# EAGLE design main_board (EAGLE 9.6.2)
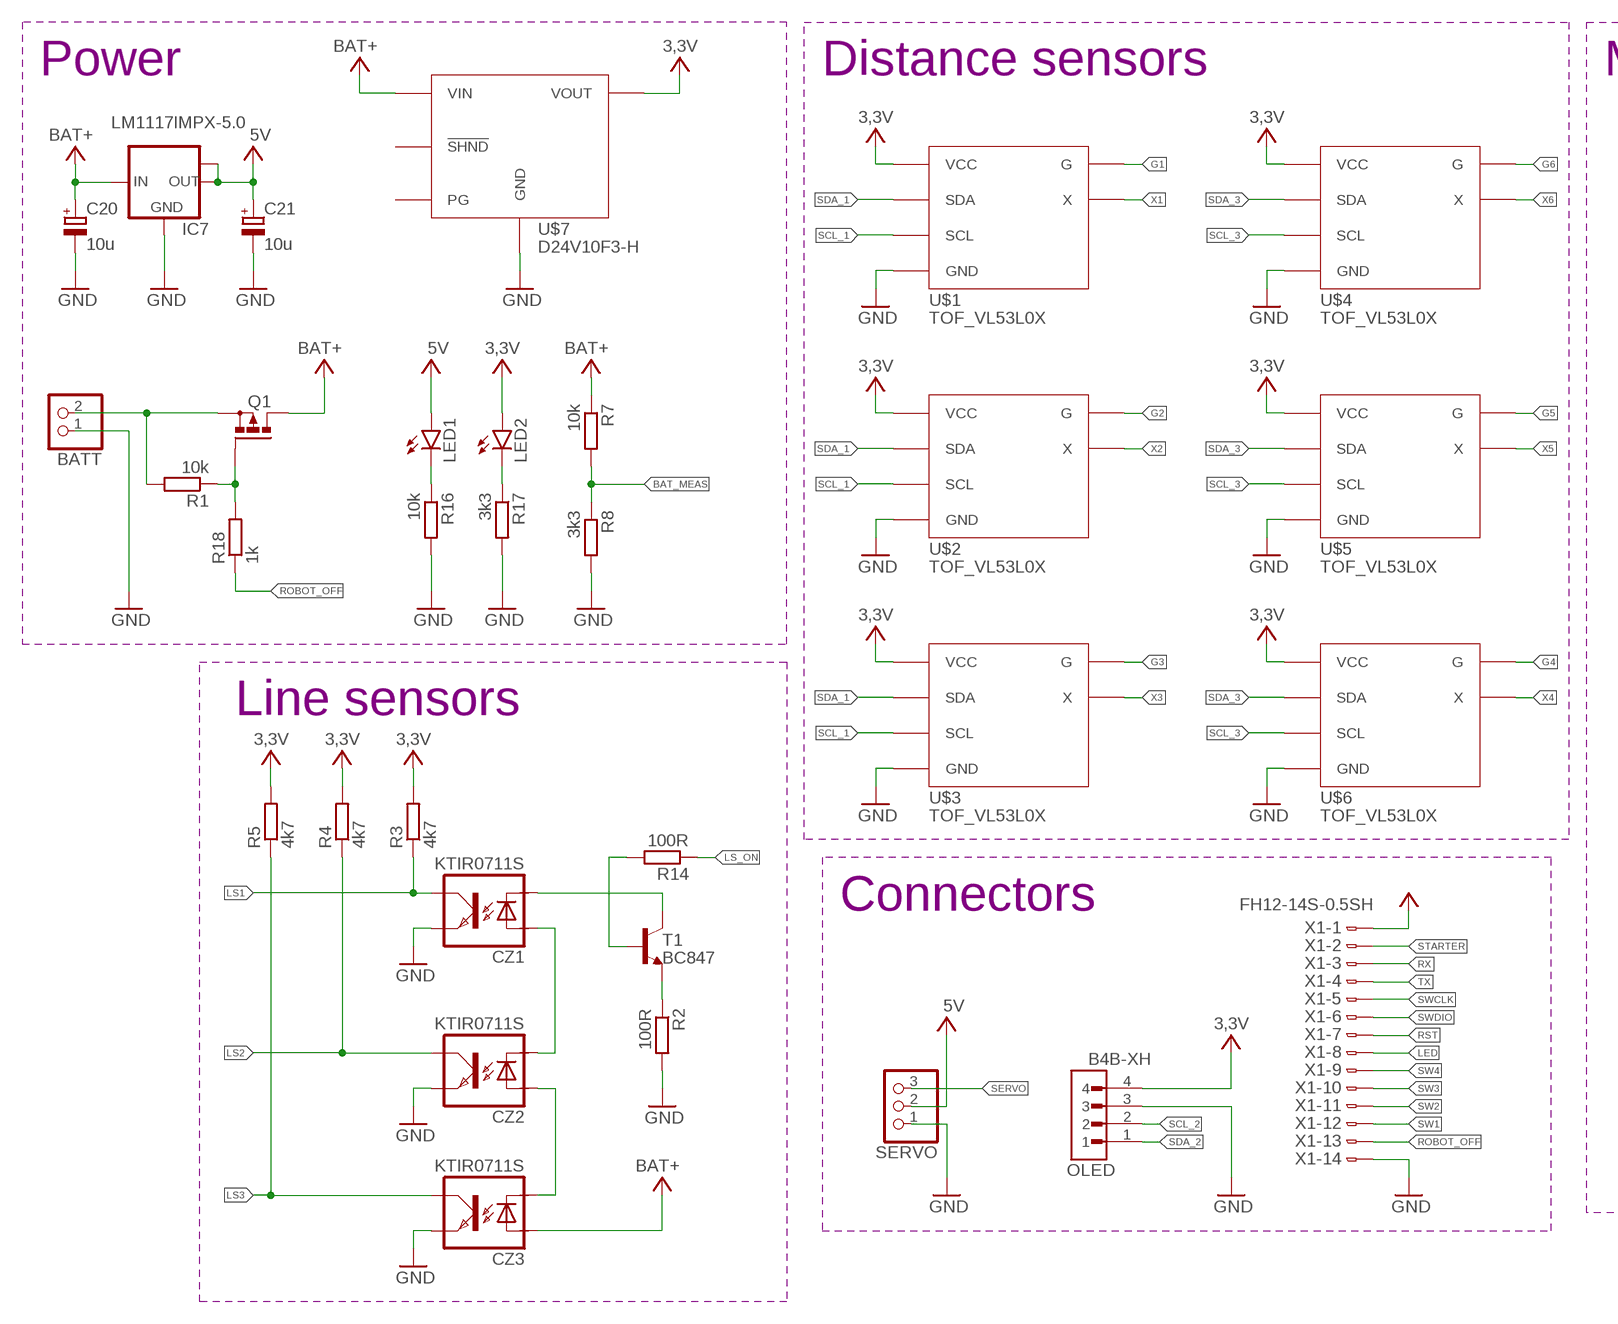
[diagram p0: schematic, sheet 1, part 1 of 2]
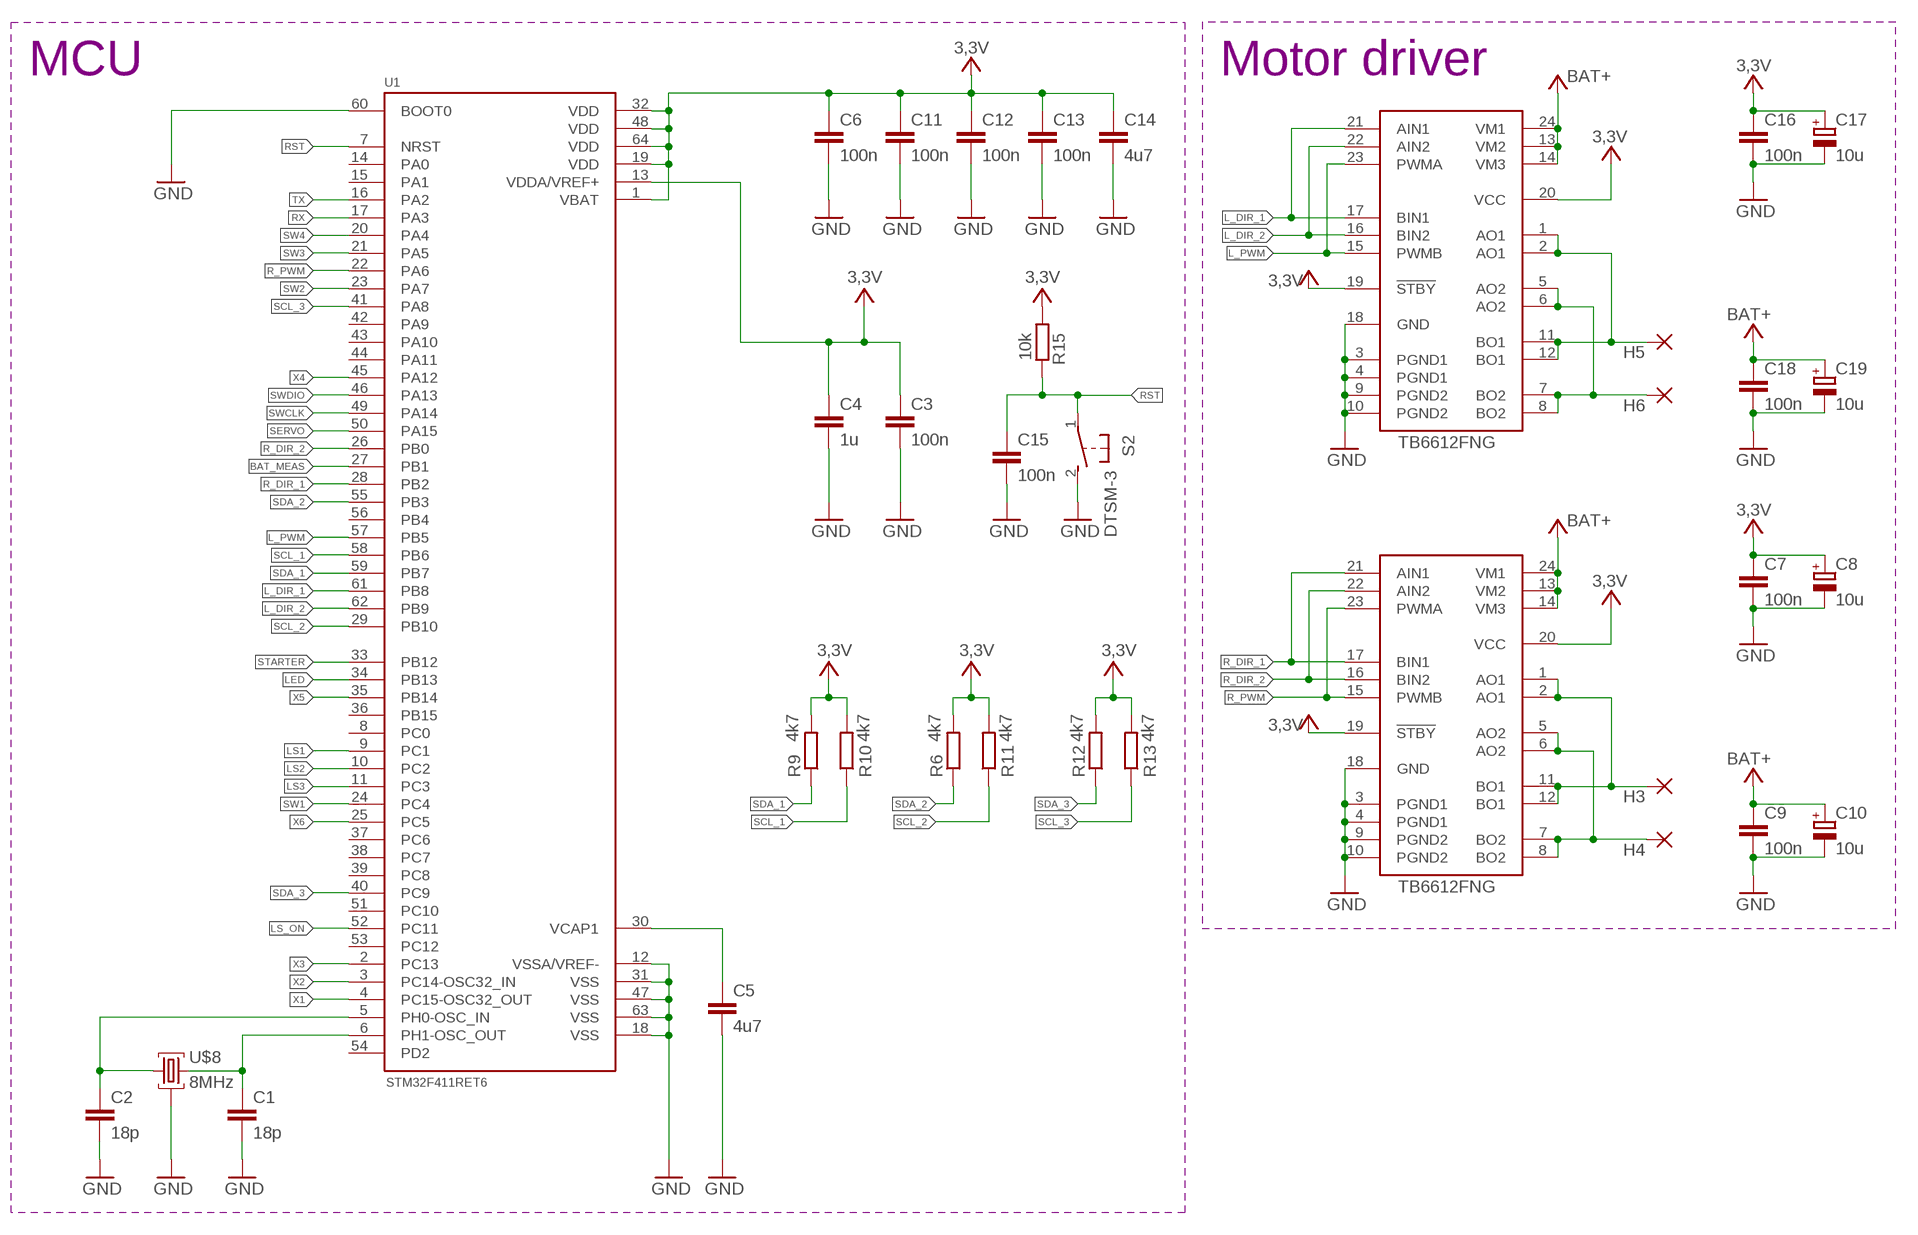
[diagram p1: schematic, sheet 1, part 2 of 2]

## Parts
BATT  PINHD-1X2  [1X02]
C1  18p  C-EUC0603  [C0603]
C2  18p  C-EUC0603  [C0603]
C3  100n  C-EUC0603  [C0603]
C4  1u  C-EUC0603  [C0603]
C5  4u7  C-EUC0603  [C0603]
C6  100n  C-EUC0603  [C0603]
C7  100n  C-EUC0603  [C0603]
C8  10u  CPOL-EUB/3528-21W  [B/3528-21W]
C9  100n  C-EUC0603  [C0603]
C10  10u  CPOL-EUB/3528-21W  [B/3528-21W]
C11  100n  C-EUC0603  [C0603]
C12  100n  C-EUC0603  [C0603]
C13  100n  C-EUC0603  [C0603]
C14  4u7  C-EUC0603  [C0603]
C15  100n  C-EUC0603  [C0603]
C16  100n  C-EUC0603  [C0603]
C17  10u  CPOL-EUB/3528-21W  [B/3528-21W]
C18  100n  C-EUC0603  [C0603]
C19  10u  CPOL-EUB/3528-21W  [B/3528-21W]
C20  10u  CPOL-EUB/3528-21W  [B/3528-21W]
C21  10u  CPOL-EUB/3528-21W  [B/3528-21W]
CZ1  KTIR0711S  [TOP]
CZ2  KTIR0711S  [TOP]
CZ3  KTIR0711S  [TOP]
H3  1,6/0,8  [1,6/0,8]
H4  1,6/0,8  [1,6/0,8]
H5  1,6/0,8  [1,6/0,8]
H6  1,6/0,8  [1,6/0,8]
IC7  LM1117IMPX-5.0  [SOT223]
LED1  LEDCHIPLED_0603  [CHIPLED_0603]
LED2  LEDCHIPLED_0603  [CHIPLED_0603]
OLED  B4B-XH  [JST_B4B-XH-A(LF)(SN)]
Q1  P-MOSFET-SO8  [SO-08]
R1  10k  R-EU_R0603  [R0603]
R2  100R  R-EU_R0603  [R0603]
R3  4k7  R-EU_R0603  [R0603]
R4  4k7  R-EU_R0603  [R0603]
R5  4k7  R-EU_R0603  [R0603]
R6  4k7  R-EU_R0603  [R0603]
R7  10k  R-EU_R0603  [R0603]
R8  3k3  R-EU_R0603  [R0603]
R9  4k7  R-EU_R0603  [R0603]
R10  4k7  R-EU_R0603  [R0603]
R11  4k7  R-EU_R0603  [R0603]
R12  4k7  R-EU_R0603  [R0603]
R13  4k7  R-EU_R0603  [R0603]
R14  100R  R-EU_R0603  [R0603]
R15  10k  R-EU_R0603  [R0603]
R16  10k  R-EU_R0603  [R0603]
R17  3k3  R-EU_R0603  [R0603]
R18  1k  R-EU_R0603  [R0603]
S2  DTSM-3  [DTSM-3]
SERVO  PINHD-1X3  [1X03]
T1  BC847  [SOT23]
TB6612  TB6612FNG  [SSOP24]
TB6612_  TB6612FNG  [SSOP24]
U1  STM32F411RET6  [QFP50P1200X1200X160-64N]
U$1  TOF_VL53L0X  [TOF_VL53L0X]
U$2  TOF_VL53L0X  [TOF_VL53L0X]
U$3  TOF_VL53L0X  [TOF_VL53L0X]
U$4  TOF_VL53L0X  [TOF_VL53L0X]
U$5  TOF_VL53L0X  [TOF_VL53L0X]
U$6  TOF_VL53L0X  [TOF_VL53L0X]
U$7  D24V10F3-H  [D24V10F3-H]
U$8  8MHz  CRYSTAL_3,4X2,7  [CRYSTAL_3,4X2,7]
X1  FH12-14S-0.5SH  [FH12-14S-0.5SH]

## Nets
3,3V: C3.1 C4.1 C6.1 C7.1 C8.+ C11.1 C12.1 C13.1 C14.1 C16.1 C17.+ LED2.A OLED.4 R3.2 R4.2 R5.2 R6.2 R9.2 R10.2 R11.2 R12.2 R13.2 R15.1 TB6612.19(!STBY) TB6612.20(VCC) TB6612_.19(!STBY) TB6612_.20(VCC) U1.1(VBAT) U1.13(VDDA/VREF+) U1.19(VDD) U1.32(VDD) U1.48(VDD) U1.64(VDD) U$1.VCC U$1.VCC_(VCC) U$2.VCC U$2.VCC_(VCC) U$3.VCC U$3.VCC_(VCC) U$4.VCC U$4.VCC_(VCC) U$5.VCC U$5.VCC_(VCC) U$6.VCC U$6.VCC_(VCC) U$7.VOUT X1.1 ; supply symbol labelled VCC
5V: C21.+ IC7.2(OUT) IC7.TAB(OUT1) LED1.A SERVO.2 ; supply symbol labelled VCC
BAT: BATT.2 Q1.1(S) Q1.2(S) Q1.3(S) R1.2
BAT+: C9.1 C10.+ C18.1 C19.+ C20.+ CZ3.ANODA IC7.3(IN) Q1.5(D) Q1.6(D) Q1.7(D) Q1.8(D) R7.1 TB6612.13(VM2) TB6612.14(VM3) TB6612.24(VM1) TB6612_.13(VM2) TB6612_.14(VM3) TB6612_.24(VM1) U$7.VIN ; supply symbol labelled VCC
BAT_MEAS: R7.2 R8.1 U1.27(PB1)
BO1: H3.1(P) TB6612.1(AO1) TB6612.2(AO1) TB6612.11(BO1) TB6612.12(BO1)
BO2: H4.1(P) TB6612.5(AO2) TB6612.6(AO2) TB6612.7(BO2) TB6612.8(BO2)
BO3: H5.1(P) TB6612_.1(AO1) TB6612_.2(AO1) TB6612_.11(BO1) TB6612_.12(BO1)
BO4: H6.1(P) TB6612_.5(AO2) TB6612_.6(AO2) TB6612_.7(BO2) TB6612_.8(BO2)
G1: U$1.G
G2: U$2.G
G3: U$3.G
G4: U$6.G
G5: U$5.G
G6: U$4.G
GND: BATT.1 C1.2 C2.2 C3.2 C4.2 C5.2 C6.2 C7.2 C8.- C9.2 C10.- C11.2 C12.2 C13.2 C14.2 C15.2 C16.2 C17.- C18.2 C19.- C20.- C21.- CZ1.EMITER CZ2.EMITER CZ3.EMITER IC7.1(GND) OLED.3 R2.2 R8.2 R16.2 R17.2 S2.2 SERVO.1 TB6612.3(PGND1) TB6612.4(PGND1) TB6612.9(PGND2) TB6612.10(PGND2) TB6612.18(GND) TB6612_.3(PGND1) TB6612_.4(PGND1) TB6612_.9(PGND2) TB6612_.10(PGND2) TB6612_.18(GND) U1.12(VSSA/VREF-) U1.18(VSS) U1.31(VSS) U1.47(VSS) U1.60(BOOT0) U1.63(VSS) U$1.GND U$1.GND_(GND) U$2.GND U$2.GND_(GND) U$3.GND U$3.GND_(GND) U$4.GND U$4.GND_(GND) U$5.GND U$5.GND_(GND) U$6.GND U$6.GND_(GND) U$7.GND U$8.GND U$8.GND2 X1.14
L_DIR_1: TB6612_.17(BIN1) TB6612_.21(AIN1) U1.61(PB8)
L_DIR_2: TB6612_.16(BIN2) TB6612_.22(AIN2) U1.62(PB9)
L_PWM: TB6612_.15(PWMB) TB6612_.23(PWMA) U1.57(PB5)
LED: U1.34(PB13) X1.8
LS1: CZ1.KOLEKTOR R3.1 U1.9(PC1)
LS2: CZ2.KOLEKTOR R4.1 U1.10(PC2)
LS3: CZ3.KOLEKTOR R5.1 U1.11(PC3)
LS_ON: R14.1 U1.52(PC11)
N$1: LED1.C R16.1
N$2: CZ1.KATODA T1.3(C)
N$3: CZ1.ANODA CZ2.KATODA
N$4: CZ2.ANODA CZ3.KATODA
N$5: R14.2 T1.1(B)
N$6: R2.1 T1.2(E)
N$7: LED2.C R17.1
N$8: Q1.4(G) R1.1 R18.2
R_DIR_1: TB6612.17(BIN1) TB6612.21(AIN1) U1.28(PB2)
R_DIR_2: TB6612.16(BIN2) TB6612.22(AIN2) U1.26(PB0)
R_PWM: TB6612.15(PWMB) TB6612.23(PWMA) U1.22(PA6)
ROBOT_OFF: R18.1 X1.13
RST: C15.1 R15.2 S2.1 U1.7(NRST) X1.7
RX: U1.17(PA3) X1.3
SCL_1: R10.1 U1.58(PB6) U$1.SCL U$1.SCL_(SCL) U$2.SCL U$2.SCL_(SCL) U$3.SCL U$3.SCL_(SCL)
SCL_2: OLED.2 R11.1 U1.29(PB10)
SCL_3: R13.1 U1.41(PA8) U$4.SCL U$4.SCL_(SCL) U$5.SCL U$5.SCL_(SCL) U$6.SCL U$6.SCL_(SCL)
SDA_1: R9.1 U1.59(PB7) U$1.SDA U$1.SDA_(SDA) U$2.SDA U$2.SDA_(SDA) U$3.SDA U$3.SDA_(SDA)
SDA_2: OLED.1 R6.1 U1.55(PB3)
SDA_3: R12.1 U1.40(PC9) U$4.SDA U$4.SDA_(SDA) U$5.SDA U$5.SDA_(SDA) U$6.SDA U$6.SDA_(SDA)
SERVO: SERVO.3 U1.50(PA15)
STARTER: U1.33(PB12) X1.2
SW1: U1.24(PC4) X1.12
SW2: U1.23(PA7) X1.11
SW3: U1.21(PA5) X1.10
SW4: U1.20(PA4) X1.9
SWCLK: U1.49(PA14) X1.5
SWDIO: U1.46(PA13) X1.6
TX: U1.16(PA2) X1.4
VCAP: C5.1 U1.30(VCAP1)
X1: U1.4(PC15-OSC32_OUT) U$1.X
X2: U1.3(PC14-OSC32_IN) U$2.X
X3: U1.2(PC13) U$3.X
X4: U1.45(PA12) U$6.X
X5: U1.35(PB14) U$5.X
X6: U1.25(PC5) U$4.X
XTAL1: C2.1 U1.5(PH0-OSC_IN) U$8.CRST1
XTAL2: C1.1 U1.6(PH1-OSC_OUT) U$8.CRST2
Unconnected: U1.8(PC0) U1.14(PA0) U1.15(PA1) U1.36(PB15) U1.37(PC6) U1.38(PC7) U1.39(PC8) U1.42(PA9) U1.43(PA10) U1.44(PA11) U1.51(PC10) U1.53(PC12) U1.54(PD2) U1.56(PB4) U$7.!SHDN(!SHND) U$7.PG

## Notes on the sheet
- Power | Distance sensors | MCU | Motor driver
- Line sensors
- Connectors

## Library data of the parts
BATT = pinhead:PINHD-1X2: PIN HEADER
C1-C7 C9 C11-C16 C18 = rcl:C-EU: CAPACITOR, European symbol; SPICEPREFIX: C
C8 C10 C17 C19-C21 = rcl:CPOL-EU: POLARIZED CAPACITOR, European symbol; SPICEPREFIX: C
CZ1-CZ3 = KTIR0711S:KTIR0711S
H3-H6 = wirepad:1,6/0,8: THROUGH-HOLE PAD
IC7 = lm1117:LM1117IMPX-*
LED1 LED2 = led:LED: LED OSRAM: - CHIPLED LG R971, LG N971, LY N971, LG Q971, LY Q971, LO R971, LY R971 LH N974, LH R974 LS Q976, LO Q976, LY Q976 LO Q996 - Hyper CHIPLED LW Q18S LB Q993, LB Q99A, LB R99A - SideLED LS A670, LO A670, LY A670, LG A670, LP A670 LB A673, LV A673, LT A673, LW A673 LH A674 LY A675 LS A676, LA A676, LO A676, LY A676, LW A676 LS A679, LY A679, LG A679 - Hyper Micro SIDELED® LS Y876, LA Y876, LO Y876, LY Y876 LT Y87S - SmartLED LW L88C, LW L88S LB L89C, LB L89S, LG L890 LS L89K, LO L89K, LY L89K LS L896, LA L896, LO L896, LY L896 - TOPLED LS T670, LO T670, LY T670, LG T670, LP T670 LSG T670, LSP T670, LSY T670, LOP T670, LYG T670 LG T671, LOG T671, LSG T671 LB T673, LV T673, LT T673, LW T673 LH T674 LS T676, LA T676, LO T676, LY T676, LB T676, LH T676, LSB T676, LW T676 LB T67C, LV T67C, LT T67C, LS T67K, LO T67K, LY T67K, LW E67C LS E67B, LA E67B, LO E67B, LY E67B, LB E67C, LV E67C, LT E67C LW T67C LS T679, LY T679, LG T679 LS T770, LO T770, LY T770, LG T770, LP T770 LB T773, LV T773, LT T773, LW T773 LH T774 LS E675, LA E675, LY E675, LS T675 LS T776, LA T776, LO T776, LY T776, LB T776 LHGB T686 LT T68C, LB T68C - Hyper Mini TOPLED® LB M676 - Mini TOPLED Santana® LG M470 LS M47K, LO M47K, LY M47K Source: http://www.osram.convergy.de LUXEON: - LUMILED® LXK2-PW12-R00, LXK2-PW12-S00, LXK2-PW14-U00, LXK2-PW14-V00 LXK2-PM12-R00, LXK2-PM12-S00, LXK2-PM14-U00 LXK2-PE12-Q00, LXK2-PE12-R00, LXK2-PE12-S00, LXK2-PE14-T00, LXK2-PE14-U00 LXK2-PB12-K00, LXK2-PB12-L00, LXK2-PB12-M00, LXK2-PB14-N00, LXK2-PB14-P00, LXK2-PB14-Q00 LXK2-PR12-L00, LXK2-PR12-M00, LXK2-PR14-Q00, LXK2-PR14-R00 LXK2-PD12-Q00, LXK2-PD12-R00, LXK2-PD12-S00 LXK2-PH12-R00, LXK2-PH12-S00 LXK2-PL12-P00, LXK2-PL12-Q00, LXK2-PL12-R00 Source: www.luxeon.com KINGBRIGHT: KA-3528ASYC Source: www.kingbright.com
OLED = jst connectors:B4B-XH: Check availability <https://pricing.snapeda.com/parts/B4B-XH-A%28LF%29%28SN%29/JST%20Sales%20America%20Inc./view-part?ref=eda>; AVAILABILITY: In Stock; DESCRIPTION: Connector Header Through Hole 4 position 0.098 (2.50mm); MF: JST Sales America Inc.; MP: B4B-XH-A(LF)(SN); PACKAGE: None; PRICE: None; PURCHASE-URL: https://pricing.snapeda.com/search/part/B4B-XH-A(LF)(SN)/?ref=eda
Q1 = transistor-power:P-MOSFET-SO8: P-Channel MOSFET Example: FDS4435A; P-Channel Logic Level PowerTrench® MOSFET FDS4465; P-Channel 1.8V Specified PowerTrench® MOSFET Source: www.fairchildsemi.com
R1-R18 = rcl:R-EU_: RESISTOR, European symbol; SPICEPREFIX: R
S2 = switch-tact:DTSM-3
SERVO = pinhead:PINHD-1X3: PIN HEADER
T1 = transistor:BC847: NPN TRANSISTOR
TB6612 TB6612_ = tb6612:TB6612FNG
U1 = STM32F411RET6:STM32F411RET6: High-performance access line, ARM Cortex-M4 core with DSP and FPU, 512 Kbytes Flash, 100 MHz CPU, ART Accelerator Check availability <https://pricing.snapeda.com/parts/STM32F411RET6/STMicroelectronics/view-part?ref=eda>; AVAILABILITY: In Stock; DESCRIPTION: ARM® Cortex®-M4 STM32F4 Microcontroller IC 32-Bit Single-Core 100MHz 512KB (512K x 8) FLASH 64-LQFP (10x10); MF: STMicroelectronics; MP: STM32F411RET6; PACKAGE: LQFP-64 STMicroelectronics; PRICE: None; PURCHASE-URL: https://pricing.snapeda.com/search/part/STM32F411RET6/?ref=eda
U$1-U$6 = TOF_VL53L0X:TOF_VL53L0X
U$7 = D24V10F3:D24V10F3
U$8 = CRYSTAL_SMD_3,4x2.7mm:CRYSTAL_3,4X2,7
X1 = con-hirose:FH12-14S-0.5S: 0.5mm Pitch Connectors For FPC/FFC Source: Data sheet <http://www.hirose.co.jp/cataloge_hp/e58605370.pdf>; MPN: MC34827; OC_FARNELL: 1324544; OC_NEWARK: 41P0493

## Board
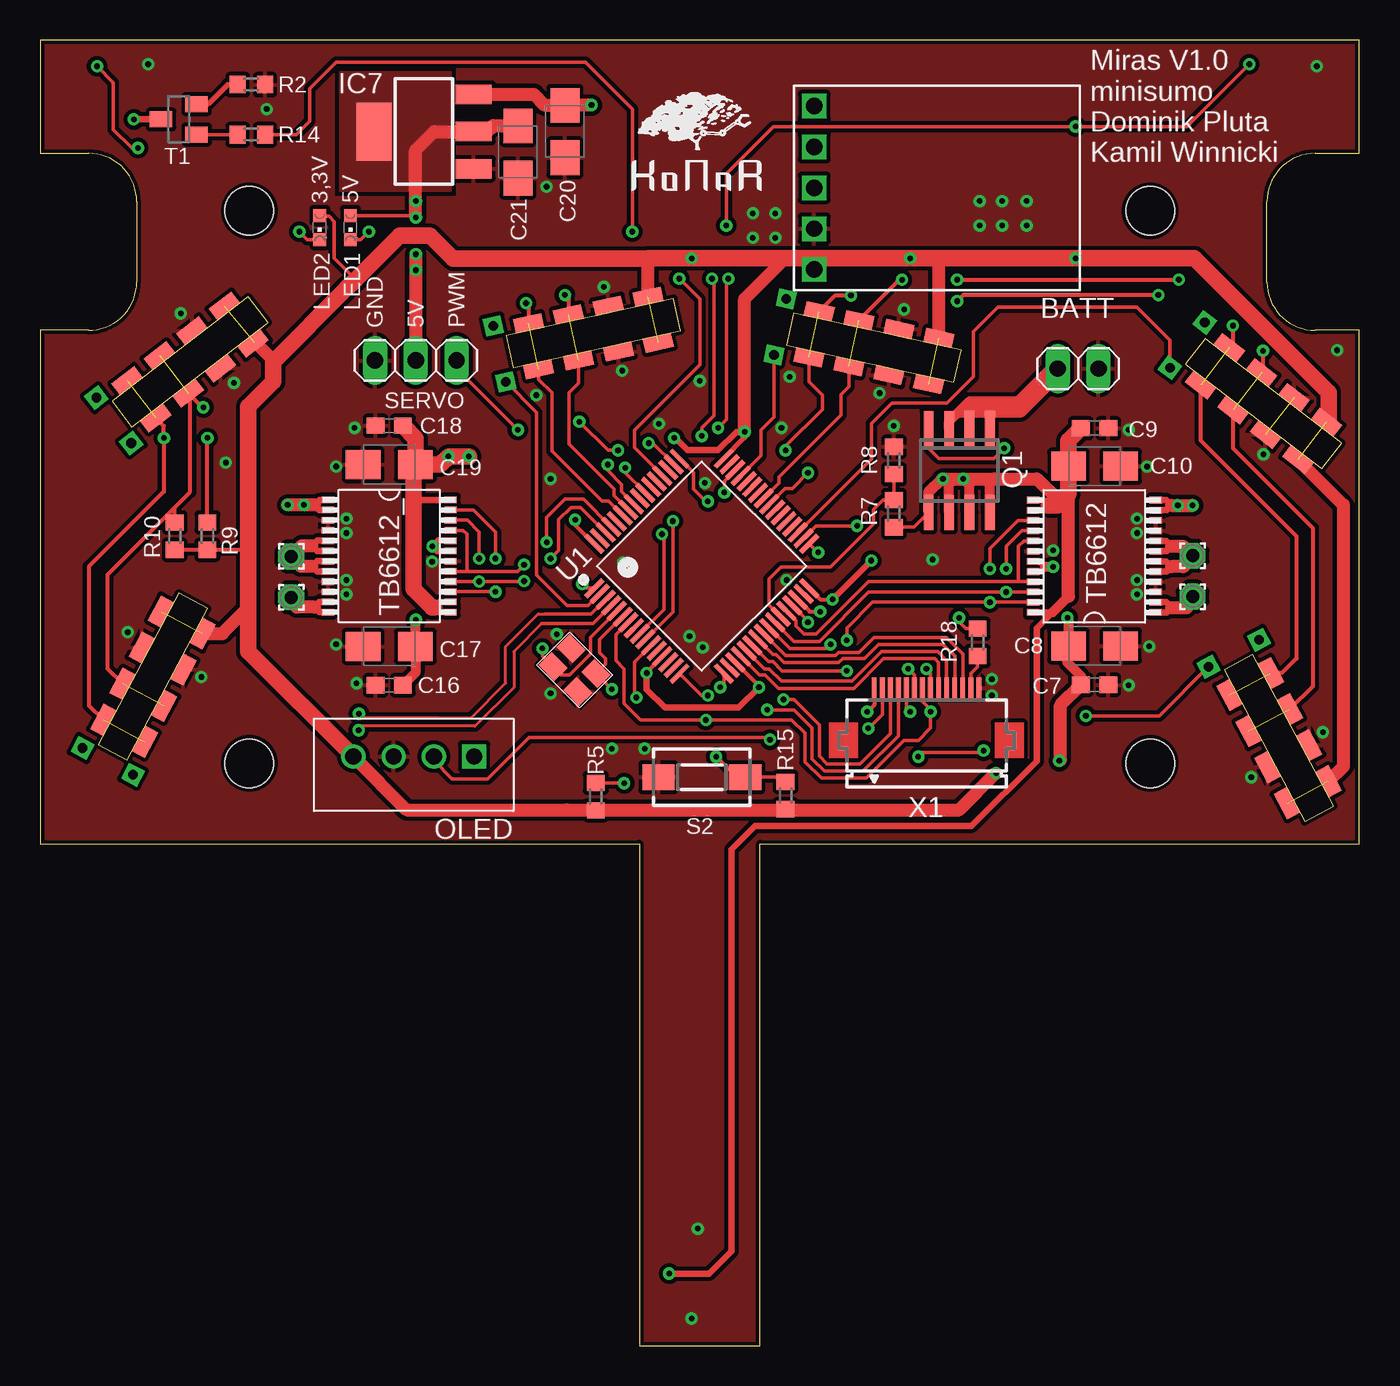
[diagram p2: board, top side]
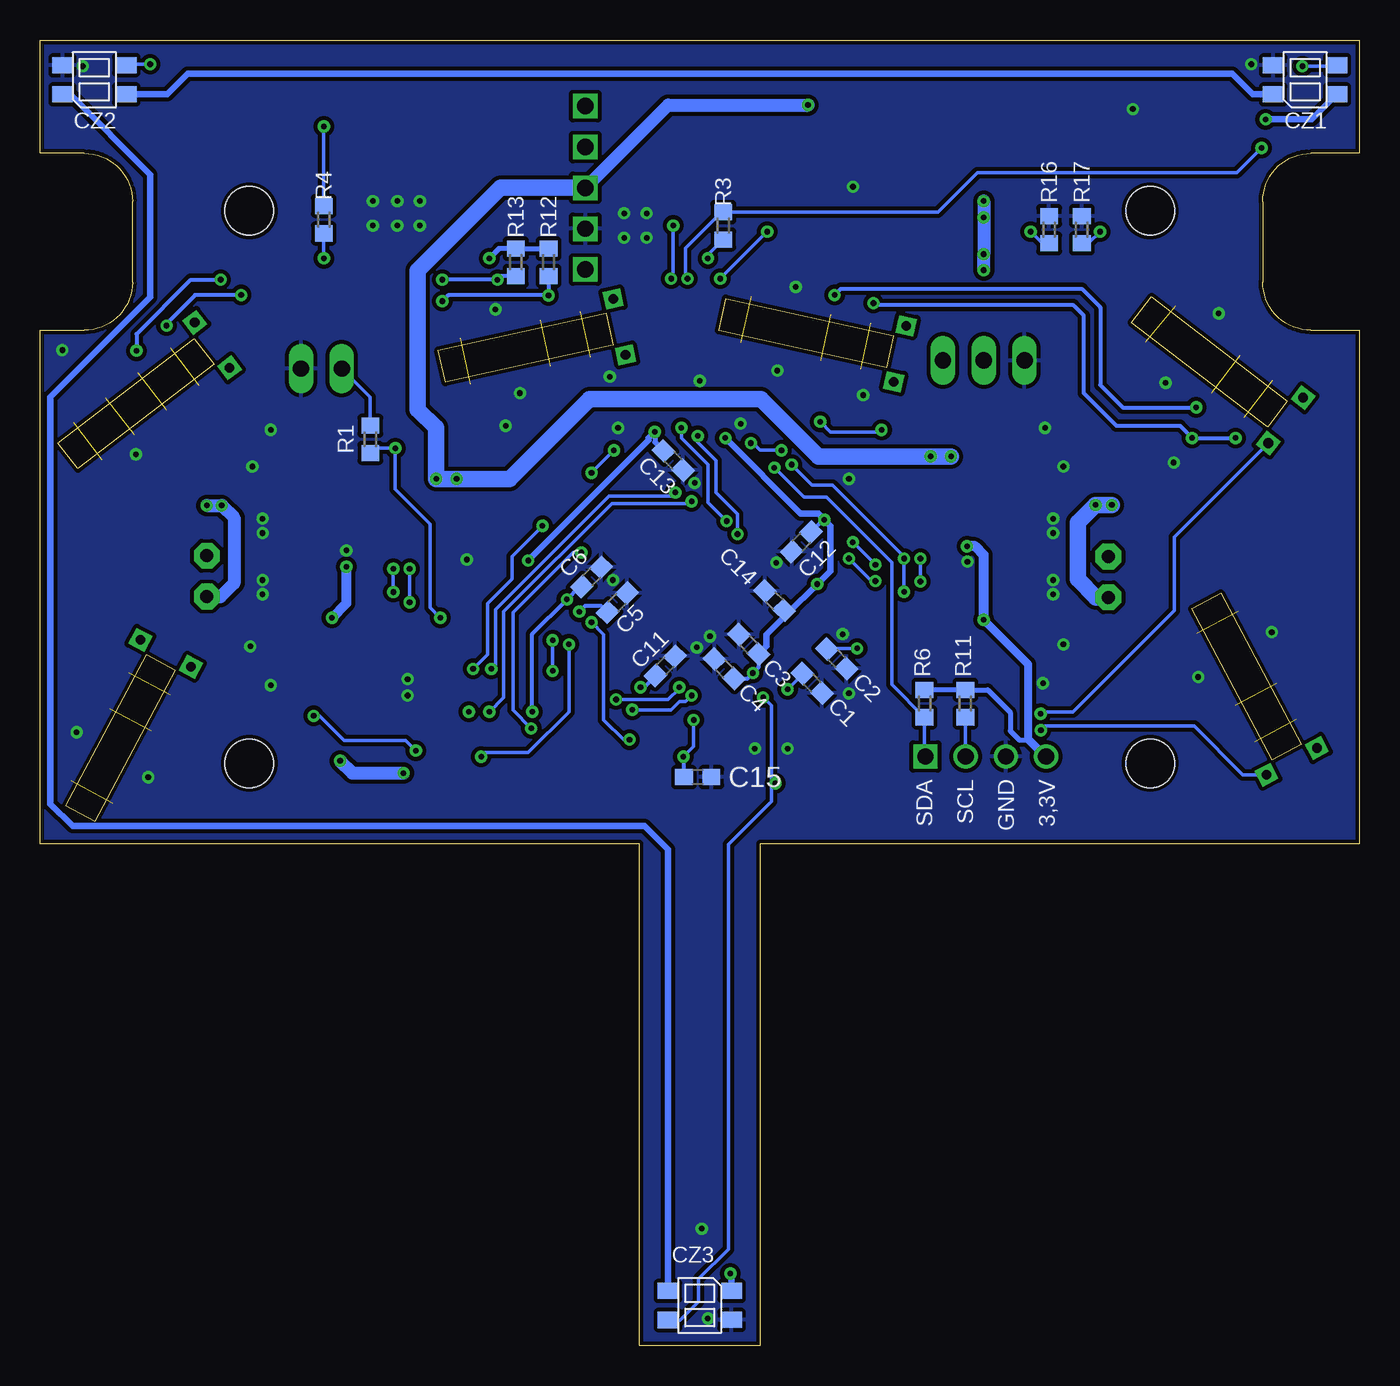
[diagram p3: board, bottom side, seen from below]

Size 82 x 81.16 mm. Coordinates in mm from the lower left corner, seen from the top.
Outline: 82,74.13 82,81.16 0,81.16 0,74.13 3,74.13 arc-90 6,71.13 6,66.13 arc-90 3,63.13 0,63.13 0,31.2 37.25,31.2 37.25,0 44.75,0 44.75,31.2 82,31.2 82,63.13 79.26,63.13 arc-90 76.26,66.13 76.26,71.13 arc-90 79.26,74.13 82,74.13
Copper layers (1*16): Top 0.035mm / dielectric 1.5mm / Bottom 0.035mm
Design rules "default *": minimum track width 6mil, minimum drill 0.35mm, track to track 6mil, track to pad 6mil, pad to pad 6mil, via to via 6mil, smd to smd 6mil, copper to edge 1mil, drill to drill 6mil, minimum pad ring 10mil, minimum via ring 8mil, stop-mask expansion 4mil, vias tented up to drill 14mil, thermal gap 10mil
Holes 3 mm at 13,70.55 69,70.55 13,36.2 69,36.2
tKeepout: area 66,33.2 to 72,39.2; area 10.1,33.2 to 16.1,39.2; area 10.1,67.5 to 16.1,73.5; area 66,67.5 to 72,73.5

### Footprints (pad centres in the part's own frame; a part is rotated, then mirrored left to right if it is on the bottom)
1X02 = drill 1.016 long: 1 -1.27,0; 2 1.27,0
C0603 = smd 1.1 x 1: 1 -0.85,0; 2 0.85,0
B/3528-21W = smd 2.15 x 1.8: + 1.625,0; - -1.625,0
TOP = smd 1.27 x 1: ANODA -1.985,-0.9; EMITER -1.985,0.9; KATODA 1.985,-0.9; KOLEKTOR 1.985,0.91
1,6/0,8 = drill 0.813 pad 1.6 octagon: 1 0,0
SOT223 = smd 1.219 x 2.235: 1 -2.311,-3.099; 2 0,-3.099; 3 2.311,-3.099 | smd 3.6 x 2.2: TAB 0,3.099
CHIPLED_0603 = smd 0.8 x 0.8: A 0,-0.75; C 0,0.75
JST_B4B-XH-A(LF)(SN) = drill 1 square: 1 -3.75,-0.525 | drill 1: 2 -1.25,-0.525; 3 1.25,-0.525; 4 3.75,-0.525
SO-08 = smd 0.6 x 2.2: 1 -1.905,-2.6; 2 -0.635,-2.6; 3 0.635,-2.6; 4 1.905,-2.6; 5 1.905,2.6; 6 0.635,2.6; 7 -0.635,2.6; 8 -1.905,2.6
R0603 = smd 1 x 1.1: 1 -0.85,0; 2 0.85,0
DTSM-3 = smd 2 x 1.6: 1 -2.7,0; 2 2.7,0
1X03 = drill 1.016 long: 1 -2.54,0; 2 0,0; 3 2.54,0
SOT23 = smd 1 x 1.4: 1 -0.95,-1.1; 2 0.95,-1.1; 3 0,1.1
SSOP24 = smd 0.406 x 0.762: 1 -3.651,-3.81; 2 -3.016,-3.81; 3 -2.381,-3.81; 4 -1.746,-3.81; 5 -1.111,-3.81; 6 -0.476,-3.81; 7 0.159,-3.81; 8 0.794,-3.81; 9 1.429,-3.81; 10 2.064,-3.81; 11 2.699,-3.81; 12 3.334,-3.81; 13 3.334,3.81; 14 2.699,3.81; 15 2.064,3.81; 16 1.429,3.81; 17 0.794,3.81; 18 0.159,3.81; 19 -0.476,3.81; 20 -1.111,3.81; 21 -1.746,3.81; 22 -2.381,3.81; 23 -3.016,3.81; 24 -3.651,3.81
QFP50P1200X1200X160-64N = smd 1.5 x 0.3: 1 -5.7,3.75; 2 -5.7,3.25; 3 -5.7,2.75; 4 -5.7,2.25; 5 -5.7,1.75; 6 -5.7,1.25; 7 -5.7,0.75; 8 -5.7,0.25; 9 -5.7,-0.25; 10 -5.7,-0.75; 11 -5.7,-1.25; 12 -5.7,-1.75; 13 -5.7,-2.25; 14 -5.7,-2.75; 15 -5.7,-3.25; 16 -5.7,-3.75; 33 5.7,-3.75; 34 5.7,-3.25; 35 5.7,-2.75; 36 5.7,-2.25; 37 5.7,-1.75; 38 5.7,-1.25; 39 5.7,-0.75; 40 5.7,-0.25; 41 5.7,0.25; 42 5.7,0.75; 43 5.7,1.25; 44 5.7,1.75; 45 5.7,2.25; 46 5.7,2.75; 47 5.7,3.25; 48 5.7,3.75 | smd 0.3 x 1.5: 17 -3.75,-5.7; 18 -3.25,-5.7; 19 -2.75,-5.7; 20 -2.25,-5.7; 21 -1.75,-5.7; 22 -1.25,-5.7; 23 -0.75,-5.7; 24 -0.25,-5.7; 25 0.25,-5.7; 26 0.75,-5.7; 27 1.25,-5.7; 28 1.75,-5.7; 29 2.25,-5.7; 30 2.75,-5.7; 31 3.25,-5.7; 32 3.75,-5.7; 49 3.75,5.7; 50 3.25,5.7; 51 2.75,5.7; 52 2.25,5.7; 53 1.75,5.7; 54 1.25,5.7; 55 0.75,5.7; 56 0.25,5.7; 57 -0.25,5.7; 58 -0.75,5.7; 59 -1.25,5.7; 60 -1.75,5.7; 61 -2.25,5.7; 62 -2.75,5.7; 63 -3.25,5.7; 64 -3.75,5.7
TOF_VL53L0X = drill 0.6 square: G -0.635,2.794; X -0.635,-0.762 | smd 1.778 x 0.914: GND 6.604,-0.445; GND_ 6.604,2.477; SCL 4.064,-0.445; SCL_ 4.064,2.477; SDA 1.524,-0.445; SDA_ 1.524,2.477; VCC 9.144,-0.445; VCC_ 9.144,2.477
D24V10F3-H = drill 1.016 square: !SHDN 3.81,1.27; GND 8.89,1.27; PG 1.27,1.27; VIN 6.35,1.27; VOUT 11.43,1.27
CRYSTAL_3,4X2,7 = smd 1.4 x 1.15: CRST1 0,-1.6; CRST2 2.2,0; GND 0,0; GND2 2.2,-1.6
FH12-14S-0.5SH = smd 0.3 x 1.3: 1 -3.25,3.25; 2 -2.75,3.25; 3 -2.25,3.25; 4 -1.75,3.25; 5 -1.25,3.25; 6 -0.75,3.25; 7 -0.25,3.25; 8 0.25,3.25; 9 0.75,3.25; 10 1.25,3.25; 11 1.75,3.25; 12 2.25,3.25; 13 2.75,3.25; 14 3.25,3.25

### Placement (x,y rotation side)
BATT  64.52,60.74 180 top
C1  22p  [C0603]  34.02,41.19 315 bottom
C2  22p  [C0603]  32.49,42.71 315 bottom
C3  37.95,43.6 135 bottom
C4  39.48,42.08 135 bottom
C5  46.13,46.19 45 bottom
C6  47.73,47.79 45 bottom
C7  65.55,41.09 0 top
C8  65.55,43.5 180 top
C9  65.55,57.04 0 top
C10  65.55,54.68 180 top
C11  43.14,42.26 45 bottom
C12  34.68,49.97 225 bottom
C13  42.65,55.03 315 bottom
C14  36.35,46.32 135 bottom
C15  41.13,35.35 0 bottom
C16  21.7,41.06 180 top
C17  21.7,43.47 0 top
C18  21.7,57.19 180 top
C19  21.7,54.78 0 top
C20  32.62,75.48 90 top
C21  29.7,74.21 90 top
CZ1  3.37,78.7 0 bottom
CZ2  78.63,78.7 0 bottom
CZ3  41,2.51 180 bottom
H3  71.64,46.57 0 top
H4  71.64,49.11 0 top
H5  15.6,46.52 0 top
H6  15.6,49.06 0 top
IC7  23.86,75.48 90 top
LED1  19.28,69.51 180 top
LED2  17.38,69.51 180 top
OLED  23.22,36.11 180 top
Q1  57.13,54.4 180 top
R1  61.48,56.35 90 bottom
R2  130R  [R0603]  13.12,78.4 0 top
R3  39.54,69.62 270 bottom
R4  64.37,70 270 bottom
R5  34.54,34.14 270 top
R6  27.03,39.92 90 bottom
R7  33k?  [R0603]  53.06,51.73 90 top
R8  10k  [R0603]  53.06,55.03 90 top
R9  10.39,50.33 270 top
R10  8.36,50.33 270 top
R11  24.49,39.92 90 bottom
R12  50.4,67.35 90 bottom
R13  52.43,67.35 90 bottom
R14  13.12,75.29 180 top
R15  46.33,34.2 90 top
R16  1k?  [R0603]  19.28,69.38 90 bottom
R17  470R?  [R0603]  17.25,69.38 90 bottom
R18  58.27,43.73 90 top
S2  41.13,35.35 180 top
SERVO  23.35,61.25 0 top
T1  8.62,76.24 90 top
TB6612  65.53,49.24 90 top
TB6612_  21.7,48.93 270 top
U1  41.12,48.47 45 top
U$1  5.4,36.41 62 top
U$2  5.7,57.11 37.5 top
U$3  29.4,60.81 12.5 top
U$4  73.6,42.01 298 top
U$5  71.2,61.01 322.5 top
U$6  46.4,62.21 347.5 top
U$7  46.84,78.33 270 top
U$8  33,43.35 315 top
X1  55.1,37.63 0 top

### Tracks (layer width: path | path; a pad name or v marks a point on that pad's centre or on a via)
3,3V  (via drill 0.35)  (6 unrouted)
  Top 0.203: 64.37,40.76 C7.1 | U1.1 33.96,47.09 v33.7,47.35 | 12.51,49.48 12.93,49.06 | 46.72,33.31 46.37,33.31 R15.1 | LED2.A 17.43,70.21 17.95,70.21 18.27,69.89 18.27,67.6 19.6,66.27 19.03,65.7
  Top 0.254: U1.32 48.5,46.39 v49.26,46.39 | U1.64 33.25,51.03 v33.25,51.35 | v44.68,40.93 44.68,41.02 U1.19 | X1.1 51.85,39.84 v51.41,39.41 | v37.7,41.82 37.7,41.86 U1.13 | R5.2 32.72,33.34 32.74,33.31 | R10.2 R9.2 12.51,49.48
  Top 0.305: U1.48 43.79,56.44 v43.79,56.81
  Top 0.406: TB6612.19 62.13,48.76 62.46,48.43 62.16,48.13 TB6612.20 | v44.68,40.93 43.41,39.66 38.84,39.66 37.7,40.81 v37.7,41.82 | v43.79,56.81 43.29,56.81 42.14,55.67 40.24,55.67 39.6,56.3 39.54,56.3 v39.41,56.43 | TB6612_.20 24.73,50.05 v24.39,49.7 24.67,49.41 TB6612_.19 | v51.67,48.81 v49.26,46.39
  Top 0.61: C7.1 64.7,41.62 63.86,42.46 63.86,43.44 C8.+ 63.92,45.19 v63.86,45.25 | 62.46,48.43 v62.97,48.43 | v23.35,45.12 23.32,45.1 C17.+ 23.32,41.84 C16.1 | U$2.VCC 13.43,62.32 | 14.54,61.21 14.48,61.28
  Top 0.813: U$6.VCC_ 55.86,67.6 | 80.09,57.53 U$5.VCC_ | U$5.VCC 81,52.27 81,36.02 U$4.VCC_ | U$2.VCC 13.29,62.39 | U$3.VCC_ 37.79,67.57 37.83,67.6 | v43.79,56.81 43.79,65.06 46.33,67.6 46.59,67.6 | OLED.4 22.79,33.31 32.74,33.31 46.72,33.31 57.13,33.31 v59.41,35.6 | C7.1 63.43,39.82 63.43,36.44 v63.35,36.36 63.39,36.4 | 13.43,62.32 14.48,61.28 | U$1.VCC 11.32,44.27 12.93,45.89
  Top 1.016: 80.09,57.53 80.09,59.25 71.73,67.6 v64.37,67.6 55.86,67.6 v54.08,67.6 48.12,67.6 | 37.83,67.6 v40.49,67.6 46.59,67.6 48.12,67.6 | U$7.VOUT 48.12,67.6 | 14.48,61.28 14.48,59.93 12.93,58.39 12.93,49.06 12.93,45.89 12.93,43.17 OLED.4 | 19.47,66.14 19.03,65.7 14.54,61.21 | 19.6,66.27 22.33,69 24.24,69 25.67,67.57 37.79,67.57
  Bottom 0.203: R3.2 40.49,67.81 v40.49,67.6 | R4.2 v64.37,67.61 v64.37,67.6 | C14.1 35.54,45.51 | 35.54,45.51
  Bottom 0.254: C6.1 48.46,47.19 v49.26,46.39 51.41,44.24 v51.41,39.41 | v33.25,51.35 33.31,51.35 C12.1 | C11.1 44.47,40.93 v44.68,40.93 | C3.1 37.35,42.17 v37.7,41.82 38.05,41.48 C4.1
  Bottom 0.305: R6.2 R11.2 23.09,40.77 21.7,39.37 21.7,38.22 21.12,37.65 20.49,37.65 OLED.4 | R12.2 R13.2 53.48,68.2 v54.08,67.6 | v43.79,56.81 43.79,56.17 C13.1
  Bottom 0.406: C3.1 36.84,43.51 36.84,44.2 35.54,45.51 v33.7,47.35 32.87,48.17 32.87,50.97 v33.25,51.35 33.63,51.73 34.73,51.73 39.41,56.41 v39.41,56.43 | v43.79,56.81 44.17,56.43 44.17,56.3 v51.67,48.81
  Bottom 0.508: OLED.4 19.52,36.63 20.6,37.71 20.6,42.38 v23.35,45.12
  Bottom 0.61: v63.86,45.25 62.97,46.14 v62.97,48.43 | v23.35,45.12 23.35,49.17 23.88,49.7 v24.39,49.7
  Bottom 0.813: v63.35,36.36 62.59,35.6 v59.41,35.6
5V  (via drill 0.35)
  Top 0.203: LED1.A 23.23,70.26 v23.35,70.14
  Top 0.813: C21.+ 29.67,75.86 28.17,75.86 27.79,75.48 IC7.2 24.49,75.48 23.35,74.33 v23.35,71.16 v23.35,70.14 | SERVO.2 v23.35,66.86 v23.35,67.86
  Bottom 0.813: v23.35,66.86 v23.35,67.86 v23.35,70.14 v23.35,71.16
  pour Top (isolate 0.254, no thermals): 18.65,79.16 18.65,71.79 25.51,71.79 25.51,79.16
BAT
  Top 0.203: Q1.2 57.76,58.08 | 58.02,58.33 57.38,58.33 56.75,57.7
  Top 0.61: Q1.3 56.49,57.44 56.75,57.7 57.76,58.71 60.69,58.71 | 57.07,58.01 57.76,58.01 Q1.2 | 57.76,58.08 58.02,58.33 | Q1.1 59.03,58.08 59.29,58.33
  Top 1.27: BATT.2 60.84,58.33 59.29,58.33 58.02,58.33
  Bottom 0.203: R1.2 61.48,58.97 BATT.2
BAT+  (via drill 0.35)
  Top 0.203: R7.1 54.31,50.88 Q1.5
  Top 0.406: TB6612.13 62.38,52.57 62.72,52.24 62.42,51.94 TB6612.14 | TB6612.24 62.92,45.59 61.95,44.62 61.95,36.36 57.89,32.3 44.43,32.3 42.97,30.84 42.97,5.88 41.57,4.48 v39.09,4.48 | TB6612_.14 24.84,46.24 24.49,45.89 24.78,45.6 TB6612_.13 | TB6612_.24 23.63,52.59 23.22,53
  Top 0.61: 62.92,45.59 63.92,46.58 | Q1.5 55.22,53 | 63.23,52.62 63.23,52.24 | 55.22,53 v56.11,53.89 56.49,53.51 Q1.6 | Q1.8 59.03,53.63 59.29,53.89 | Q1.7 57.76,53.51 v57.38,53.89 | 55.22,53 55.22,53.13 55.99,53.89
  Top 0.813: 63.92,46.58 63.92,52.93 | v34.27,77.13 32.64,77.13 | 32.64,77.13 C20.+ | IC7.3 30.69,77.79 31.35,77.13 32.64,77.13 | 63.23,52.62 61.95,53.89 59.29,53.89 v57.38,53.89 v56.11,53.89
  Top 1.016: 62.72,52.24 63.23,52.24 63.92,52.93 C10.+ 63.92,56.26 C9.1 | C19.+ 23.35,54.75 23.35,56.39 C18.1 | C19.+ 23.22,54.68 23.22,53 23.22,47.03 24.36,45.89 24.49,45.89 | C19.+ 24.87,54.78 v25.38,55.28 v26.65,55.28
  Bottom 0.406: CZ3.ANODA 39.02,4.4 v39.09,4.48
  Bottom 0.813: U$7.VIN 42.97,77.13 v34.27,77.13
  Bottom 1.016: U$7.VIN 53.39,71.98 58.53,66.84 58.53,58.21 57.38,57.06 v57.38,53.89 52.81,53.89 47.86,58.84 37.19,58.84 33.63,55.28 v26.65,55.28 v25.38,55.28
BAT_MEAS
  Top 0.203: U1.27 45.32,46.04 45.32,47.66 46.06,48.41 49.11,48.41 51.8,51.09 51.8,51.98 52.39,52.58 R7.2 53.06,53.93 52.94,54.05 R8.1
BO1  (via drill 0.35)
  Top 0.406: TB6612.2 70,46.22 70.34,45.89 70.04,45.59 TB6612.1 | TB6612.12 70,52.57 70.34,52.24 70.04,51.94 TB6612.11
  Top 0.813: 70.34,52.24 v70.72,52.24 v71.64,52.24 | H3.1 71.64,46.27 71.26,45.89 70.34,45.89
  Bottom 0.813: v71.64,52.24 v70.72,52.24 69.96,51.47 69.96,47.41 70.8,46.57 H3.1
BO2
  Top 0.406: TB6612.6 70,48.76 70.34,48.43 70.04,48.13 TB6612.5 | TB6612.7 70.04,49.4 70.34,49.7 70,50.03 TB6612.8
  Top 0.813: 70.34,48.43 71.06,48.43 71.64,49.01 H4.1 71.06,49.7 70.34,49.7
BO3  (via drill 0.35)
  Top 0.406: TB6612_.11 17.35,46.24 17.03,45.92 17.35,45.6 TB6612_.12 | TB6612_.1 17.35,52.59 17.03,52.27 17.35,51.95 TB6612_.2
  Top 0.813: 17.03,52.27 v15.38,52.27 v16.39,52.27 | 17.03,45.92 15.95,45.92 15.6,46.27 H5.1
  Bottom 1.016: v15.38,52.27 v16.39,52.27 17.5,51.16 17.5,47.66 16.36,46.52 H5.1
BO4
  Top 0.406: TB6612_.8 17.22,48.14 16.9,48.46 17.22,48.78 TB6612_.7 | TB6612_.5 17.22,50.05 16.9,49.73 17.22,49.41 TB6612_.6
  Top 0.813: 16.9,49.73 16.27,49.73 H6.1 16.2,48.46 16.9,48.46
GND  (via drill 0.35, 0.35 pad 0.55)  (1 unrouted)
  Bottom 0.152: CZ3.EMITER 39.02,1.95
  other vias: 68.81,54.65 12.04,59.86 8.74,64.17 5.44,44.36 10.01,41.57 36.17,60.62 35.03,65.83 53.7,64.43 52.18,59.22 76.05,55.41 75.29,35.35 79.73,38.14 59.16,40.43 67.67,56.94 68.94,43.47 67.67,41.06 11.54,54.9 36.24,48.68 40.37,44.11 41.19,43.41 46.4,47.6 41.32,53.63 14.08,76.87 31.73,40.55 6.71,79.67 79.35,79.54 40.49,1.69 62.97,49.44 68.18,46.71 68.18,47.6 68.18,50.52 68.18,51.41 53.06,57.19 19.03,46.71 19.03,47.6 19.03,50.52 19.03,51.41 24.36,48.74 18.39,43.6 19.66,41.19 18.39,54.65 19.54,57.06 58.4,69.64 59.8,69.64 61.32,69.64 58.4,71.16 59.8,71.16 61.32,71.16 31.48,72.05 44.3,68.87 45.7,68.87 44.3,70.4 45.7,70.4 38.46,57.32 41,59.98 46.08,57.06 46.59,60.24 35.54,37.12 37.57,37.12 32.11,44.24 59.16,41.44 40.87,7.28 80.62,61.89 30.84,59.09 31.73,53.89 55.48,48.87
  pour Top (isolate 0.254, rank 2): -0.87,82.11 -0.87,-0.89 83,-0.89 83,82.11
  pour Bottom (isolate 0.254): -1,-0.89 83,-0.89 83,82.11 -1,82.11
L_DIR_1  (via drill 0.35)
  Top 0.203: TB6612_.21 26.3,50.68 26.52,50.46 26.52,48.14 | U1.61 33.79,52.62 32.62,52.62 31.48,51.48 v31.48,49.95 | TB6612_.17 26.52,48.14 | 26.52,48.14 29.66,48.14 v30.08,48.55
  Bottom 0.203: v31.48,49.95 v30.08,48.55
L_DIR_2  (via drill 0.35)
  Top 0.203: TB6612_.16 v27.28,47.51 30.05,47.51 v30.08,47.54 | TB6612_.22 26.55,51.32 27.28,50.59 v27.28,48.93 | U1.62 33.59,52.11 33,52.11 32.24,51.35 32.24,49.44 v31.73,48.93
  Bottom 0.203: v27.28,48.93 v27.28,47.51 | v31.73,48.93 30.33,47.54 v30.08,47.54
L_PWM  (via drill 0.35)
  Top 0.203: TB6612_.23 26.94,51.95 28.3,50.59 v28.3,48.93 | TB6612_.15 v28.3,46.87 | U1.57 36.15,53.09 36.15,53.53 35.28,54.39 v35.28,54.78
  Bottom 0.203: v28.3,46.87 v28.3,48.93 28.3,49.06 32.74,53.51 34.02,53.51 v35.28,54.78
LED  (via drill 0.35)
  Top 0.203: X1.8 55.35,41.82 v55.09,42.08 | U1.34 48.22,50.97 v50.77,50.97 v50.78,50.97
  Bottom 0.203: v55.09,42.08 54.2,42.97 54.2,46.15 52.68,47.67 52.68,49.06 v50.78,50.97
LS1  (via drill 0.35)
  Top 0.203: v6.08,74.46 5.69,74.46 4.55,75.6 4.55,78.53 v3.53,79.54 | U1.9 38.78,45.77 38.78,50.33 v38.65,50.46 | v41.13,56.55 41.13,57.06 41.89,57.82 41.89,66.21 v41.76,66.33
  Bottom 0.203: 3.52,79.55 1.44,79.55 | v38.65,50.46 38.65,51.7 39.98,53.03 39.98,55.03 41.13,56.17 v41.13,56.55 | v41.76,66.33 41.89,66.46 41.89,68.24 39.48,70.65 39.48,70.53 R3.1 26.2,70.47 23.73,72.94 7.6,72.94 v6.08,74.46
  Bottom 0.305: v3.53,79.54 3.52,79.55 | 1.44,79.55 CZ1.KOLEKTOR
LS2  (via drill 0.35)
  Top 0.203: v75.16,79.67 71.29,75.8 v64.37,75.8 45.57,75.8 42.65,72.87 v42.65,69.64 | v39.33,51.27 39.33,45.62 U1.10 | v42.14,57.06 42.65,57.57 42.65,66.21 v42.78,66.33
  Bottom 0.203: 76.58,79.67 v75.16,79.67 | v42.65,69.64 42.65,66.46 v42.78,66.33 | R4.1 v64.37,75.79 v64.37,75.8 | v42.14,57.06 42.14,56.43 40.49,54.78 40.49,52.43 v39.33,51.27
  Bottom 0.305: CZ2.KOLEKTOR 76.58,79.67
LS3  (via drill 0.35)
  Top 0.203: U1.11 36.94,42.52 36.94,40.43 v37.06,40.3 | v36.3,34.96 36.28,34.99 R5.1
  Bottom 0.203: CZ3.KOLEKTOR 42.22,1.6 41.08,2.74 41.08,4.15 39.22,6.01 39.22,31.15 36.55,33.82 36.55,34.71 v36.3,34.96 36.55,35.22 36.55,39.79 v37.06,40.3
LS_ON  (via drill 0.35)
  Top 0.203: v39.73,66.33 41,65.06 41,61 36.94,56.94 36.94,55.83 U1.52 | v36.81,69.25 36.81,76.87 33.89,79.8 18.39,79.8 16.74,78.14 16.74,76.11 15.92,75.29 R14.1
  Bottom 0.203: v39.73,66.33 v36.81,69.25
N$1  (via drill 0.35)
  Top 0.203: LED1.C 19.93,68.76 v20.43,69.25
  Bottom 0.203: v20.43,69.25 19.7,68.53 R16.1
N$2  (via drill 0.35)
  Top 0.406: v5.82,76.24 T1.3
  Bottom 0.406: CZ1.KATODA 2.94,76.24 v5.82,76.24
N$3
  Bottom 0.406: CZ1.ANODA 6.62,77.8 7.9,79.07 72.84,79.07 74.1,77.8 CZ2.KATODA
N$4
  Bottom 0.406: CZ2.ANODA 80.15,77.8 75.16,72.81 75.16,65.19 81.39,58.97 81.39,33.69 79.99,32.3 44.43,32.3 42.97,30.84 42.97,3.42 CZ3.KATODA
N$5
  Top 0.203: R14.2 T1.1
N$6
  Top 0.305: T1.2 10.43,77.19 11.64,78.4 R2.1
N$7  (via drill 0.35)
  Top 0.203: LED2.C 16.6,68.76 v16.11,69.25
  Bottom 0.203: v16.11,69.25 16.83,68.53 R17.1
N$8  (via drill 0.35)
  Top 0.203: Q1.4 55.22,55.79 55.86,55.16 59.29,55.16 v59.92,55.79 | R18.2 57.55,44.58 57.13,45 v57.13,45.25
  Bottom 0.203: v57.13,45.25 57.76,45.89 57.76,51.09 59.92,53.25 v59.92,55.79 61.18,55.79 R1.1
R_DIR_1
  Top 0.203: U1.28 46.97,45.09 46.97,44.74 47.48,44.24 48.24,44.24 51.49,47.49 60.81,47.49 | TB6612.21 60.81,47.49 | TB6612.17 61.15,50.03 60.81,49.7 60.81,47.49
R_DIR_2  (via drill 0.35)
  Top 0.203: U1.26 46.86,43.79 48.43,43.79 51.49,46.86 v60.05,46.86 TB6612.22 | TB6612.16 61.02,50.67 60.05,49.7 v60.05,48.3
  Bottom 0.203: v60.05,48.3 v60.05,46.86
R_PWM  (via drill 0.35)
  Top 0.203: TB6612.23 v59.03,46.22 51.75,46.22 50.14,44.62 v50.14,43.85 | TB6612.15 60.77,51.3 59.03,49.57 v59.03,48.3 | U1.22 45.28,42.54 45.54,42.54 46.12,41.95 v50.14,41.95
  Bottom 0.203: v59.03,48.3 v59.03,46.22 | v50.14,41.95 v50.14,43.85
ROBOT_OFF
  Top 0.203: X1.13 57.85,41.78 58.27,42.2 R18.1
RST  (via drill 0.35)
  Top 0.203: X1.7 54.85,40.04 55.35,39.54 v55.35,39.41 55.35,38.39 54.59,37.63 53.7,37.63 51.35,35.28 48.56,35.28 47.54,36.3 47.54,38.08 46.72,38.9 v41.38,38.9 37.32,38.9 36.3,39.92 36.3,42.08 35.79,42.58 35.79,44.21 U1.7 | R15.2 45.99,35.05 45.7,35.35 S2.1
  Top 0.254: S2.1 43.29,35.35 v42.02,36.62
  Bottom 0.203: v41.38,38.9 41.38,37.25 v42.02,36.62
  Bottom 0.254: v42.02,36.62 42.02,35.38 C15.1
RX  (via drill 0.35)
  Top 0.203: U1.17 42.5,41.16 v42.27,40.93 | v46.21,40.17 46.84,40.17 48.43,38.58 48.43,36.66 48.92,36.17 50.97,36.17 52.85,38.05 X1.3
  Bottom 0.203: v46.21,40.17 42.96,40.17 42.27,40.86 v42.27,40.93
SCL_1  (via drill 0.35)  (3 unrouted)
  Top 0.203: U1.58 35.67,52.86 35.67,53.25 32.87,56.05 32.87,59.26 33.46,59.86 U$3.SCL
  Top 0.254: 9.32,59.1 9.32,53.07 8.36,52.11 | v32.62,65.32 32.83,65.1 U$3.SCL_ | U$1.SCL_ 4.17,42.11 4.17,47.92 8.36,52.11 | v10.14,58.33 10.09,58.33 U$2.SCL | R10.1 8.36,52.11
  Top 0.406: U$2.SCL 9.32,59.1
  Bottom 0.254: v32.62,65.32 32.24,65.7 17.25,65.7 16.11,64.56 16.11,59.73 14.71,58.33 v10.14,58.33
SCL_2  (via drill 0.35)
  Top 0.203: OLED.2 24.47,36.38 25.61,35.24 27.82,35.24 30.4,37.81 45.24,37.81 v45.37,37.68 | U1.29 47.73,45.04 v47.73,44.97
  Bottom 0.203: R11.1 24.49,36.65 OLED.2 | v47.73,44.97 46.97,44.21 46.97,38.9 45.75,37.68 v45.37,37.68
SCL_3  (via drill 0.35)  (3 unrouted)
  Top 0.203: U$6.SCL 50.27,59.62 49.76,59.12 49.76,57.85 45.93,54.01 45.93,53.63 U1.41
  Top 0.254: v53.57,66.26 53.42,66.26 U$6.SCL_ | v76.02,61.85 76.02,60.58 U$5.SCL_ | U$4.SCL_ 79.1,40.99 79.1,50.84 74.15,55.79 U$5.SCL | v57,66.27 v70.78,66.27
  Bottom 0.254: v76.02,61.85 76.02,62.89 72.64,66.27 v70.78,66.27 | v56.99,66.26 v53.57,66.26 53.34,66.5 R13.1
  Bottom 0.305: v56.99,66.26 v57,66.27
SDA_1  (via drill 0.35)  (4 unrouted)
  Top 0.203: U1.59 35.32,52.5 34.94,52.5 31.81,55.63 31.81,59.24 30.98,60.07 U$3.SDA
  Top 0.254: 3.9,38.92 3.03,39.79 3.03,48.43 7.69,53.09 v7.69,56.43 7.69,57.17 U$2.SDA | v30.2,64.81 30.35,64.66 U$3.SDA_ | R9.1 v10.39,56.43
  Bottom 0.254: v30.2,64.81 30.08,64.68 17.76,64.68 17.12,64.05 17.12,59.22 15.09,57.19 11.16,57.19 v10.39,56.43 v7.69,56.43
SDA_2  (via drill 0.35)
  Top 0.203: v36.36,54.59 36.36,54.28 U1.55
  Bottom 0.203: 27.03,36.69 R6.1 29.06,41.1 29.06,48.68 33.13,52.74 34.52,52.74 v36.36,54.59
  Bottom 0.305: 27.03,36.69 OLED.1
SDA_3  (via drill 0.35)  (3 unrouted)
  Top 0.203: U$6.SDA 47.79,59.92 48.62,59.09 48.62,58.21 46.33,55.92 v46.33,55.67 | U1.40 46.3,53.29 46.75,53.29 v47.73,54.27
  Top 0.254: v50.4,65.29 49.42,65.29 U$6.SDA_ | v74.15,63.41 74.15,62.27 U$5.SDA_ | U$4.SDA_ 77.2,41.82 78.08,42.71 78.08,50.33 72.14,56.28 U$5.SDA | v69.51,65.32 57.38,65.32 v57,64.94
  Bottom 0.203: v47.73,54.27 v46.33,55.67
  Bottom 0.254: v74.15,63.41 74.15,63.54 72.37,65.32 v69.51,65.32 | v57,64.94 56.64,65.29 v50.4,65.29 R12.1
SERVO  (via drill 0.35)
  Top 0.203: U1.50 38.07,56.12 v37.82,56.12 | v35.92,55.67 35.28,55.67 v33.51,57.44 | v29.7,56.94 25.89,60.75 SERVO.3
  Bottom 0.203: v37.82,56.12 37.7,56.12 37.24,55.67 v35.92,55.67 | v33.51,57.44 32.87,56.81 29.82,56.81 v29.7,56.94
STARTER  (via drill 0.35)
  Top 0.203: X1.2 52.35,39.25 v51.48,38.38 | v48.37,49.32 47.84,49.85 U1.33
  Bottom 0.203: v51.48,38.38 52.62,39.52 52.62,45.57 48.87,49.32 v48.37,49.32
SW1
  Top 0.203: U1.24 46.33,42.9 49.45,42.9 49.64,43.09 50.91,43.09 51.83,44.02 56.33,44.02 57.35,43 X1.12
SW2
  Top 0.203: X1.11 56.85,42.87 56.11,43.6 52.11,43.6 51.22,42.71 49.89,42.71 49.64,42.46 46.25,42.46 45.74,42.97 45.56,42.97 U1.23
SW3
  Top 0.203: X1.10 56.35,42.6 55.8,43.16 52.3,43.16 50.46,41.31 46.08,41.31 45.32,42.08 45.04,42.08 U1.21
SW4
  Top 0.203: X1.9 55.85,42.47 55.61,42.71 52.43,42.71 50.59,40.87 45.89,40.87 45.06,41.7 44.71,41.7 U1.20
SWCLK  (via drill 0.35)
  Top 0.203: X1.5 53.85,39.64 v54.08,39.41 | v41.51,52.49 41.38,52.49 40.62,53.25 40.62,54.27 U1.49
  Bottom 0.203: v54.08,39.41 53.19,40.3 53.19,45.63 46.46,52.36 41.63,52.36 v41.51,52.49
SWDIO  (via drill 0.35)
  Top 0.203: v42.52,53.05 42.52,53.76 U1.46 | X1.6 54.35,41.68 v53.95,42.08
  Bottom 0.203: 42.75,52.82 46.65,52.82 53.7,45.77 53.7,42.33 v53.95,42.08
  Bottom 0.254: 42.75,52.82 v42.52,53.05
TX  (via drill 0.35)
  Top 0.203: U1.16 41.1,40.43 v41.51,40.43 | X1.4 53.35,40 53.34,39.99 53.34,37.91 51.16,35.73 48.75,35.73 47.98,36.49 47.98,38.39 46.84,39.53 v45.19,39.53
  Bottom 0.203: v41.51,40.43 41.89,40.04 42.27,40.04 42.78,39.53 v45.19,39.53
VCAP  (via drill 0.35)
  Top 0.254: U1.30 47.84,45.63 v48.49,45.63
  Bottom 0.254: C5.1 47.16,46.01 48.11,46.01 v48.49,45.63
X1  (via drill 0.35)
  Top 0.2: 31.18,44.88 29.44,43.15 29.44,40.93 27.03,38.52 20.05,38.52
  Top 0.203: 20.05,38.52 v19.79,38.27 | U1.4 34.36,44.88 31.18,44.88
  Bottom 0.203: U$1.X 7.23,35.49 10.27,38.52 19.54,38.52 v19.79,38.27
X2  (via drill 0.35)
  Top 0.2: 24.74,39.03 26.78,39.03 28.94,41.19 28.94,43.47 30.95,45.49 31.35,45.49
  Top 0.203: U1.3 34.26,45.49 31.35,45.49 | 24.74,39.03 20.05,39.03 19.81,39.26
  Top 0.254: v19.81,39.28 19.81,39.26
  Bottom 0.203: U$2.X 11.5,50.27 11.5,45.7 17.8,39.41 19.69,39.41 v19.81,39.28
X3
  Top 0.203: U$3.X 30.85,58.02 30.85,47.91 32.74,46.01 34.07,46.01 U1.2
X4
  Top 0.203: U1.45 44.81,55.34 44.81,56.94 45.62,57.74 U$6.X
X5
  Top 0.203: U$5.X 70.23,62.5 68.18,64.56 59.54,64.56 58.02,63.03 58.02,60.24 56.37,58.59 52.94,58.59 51.67,57.32 51.67,55.13 U1.35
X6  (via drill 0.35)
  Top 0.203: v49.13,43.6 48.88,43.34 46.6,43.34 U1.25 | U$4.X 69.57,39.16 v65,39.16 | v58.65,37 58.53,36.87 54.84,36.87 v54.59,36.62
  Bottom 0.203: v65,39.16 64.62,39.16 63.1,37.63 59.29,37.63 v58.65,37 | v54.59,36.62 54.34,36.87 51.67,36.87 49.13,39.41 v49.13,43.6
XTAL1  (via drill 0.35)
  Top 0.203: U1.5 34.2,44.03 34.2,43 32.91,41.71 32.38,41.71 U$8.CRST1 31.22,42.86 v31.22,43.35
  Bottom 0.203: v31.22,43.35 32.55,43.35 32.58,43.31 C2.1
XTAL2  (via drill 0.35)
  Top 0.203: U1.6 34.78,43.89 34.78,43.09 35.16,42.71 35.16,42.39 U$8.CRST2 v35.54,40.81
  Bottom 0.203: v35.54,40.81 34.62,41.73 C1.1

### Text on the board
tNames: Miras V1.0 / minisumo / Dominik Pluta / Kamil Winnicki | 3,3V | 5V | GND | 5V | PWM
bNames: 3,3V | GND | SCL | SDA